# EAGLE design InductionSensorBoardForOxCNC_v2 (EAGLE 7.5.0)
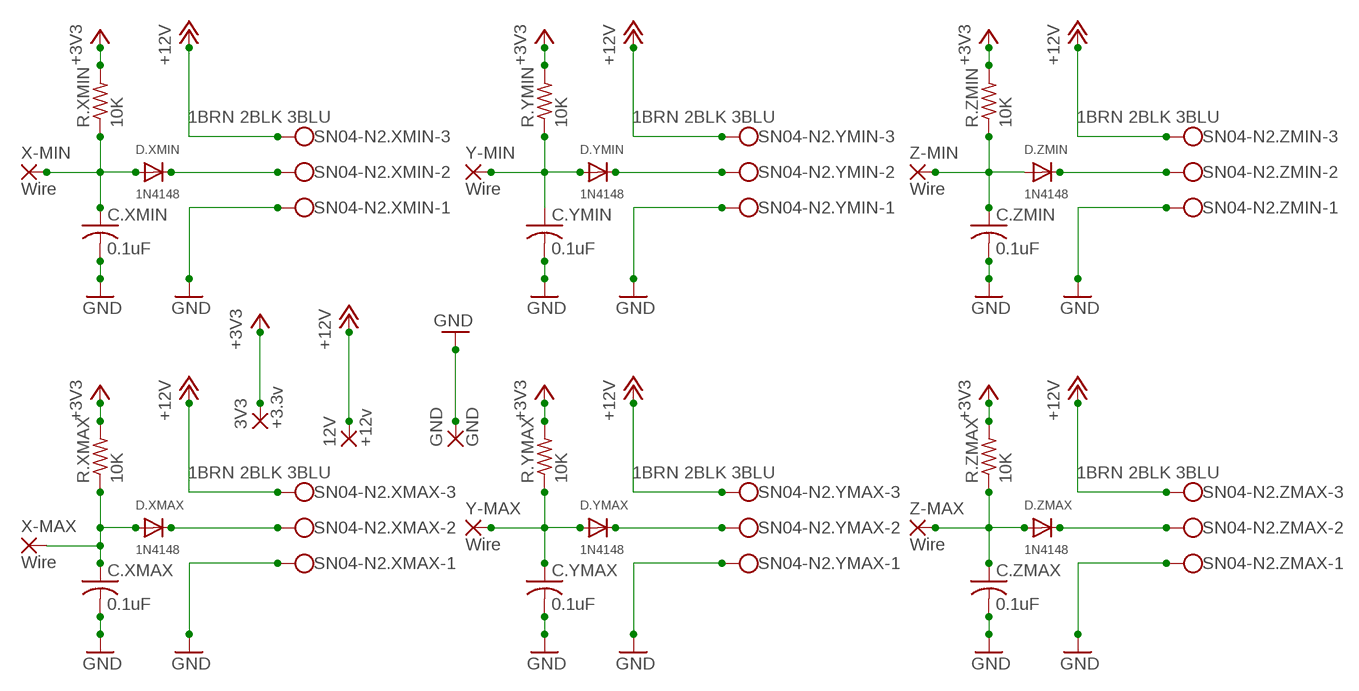
[diagram p0: schematic, sheet 1]

## Parts
3V3  +3.3v  3,81/1,4  [3,81/1,4]
12V  +12v  3,81/1,4  [3,81/1,4]
C.XMAX  0.1uF  C-US050-024X044  [C050-024X044]
C.XMIN  0.1uF  C-US050-024X044  [C050-024X044]
C.YMAX  0.1uF  C-US050-024X044  [C050-024X044]
C.YMIN  0.1uF  C-US050-024X044  [C050-024X044]
C.ZMAX  0.1uF  C-US050-024X044  [C050-024X044]
C.ZMIN  0.1uF  C-US050-024X044  [C050-024X044]
D.XMAX  1N4148  DIODEDO-1N4148  [DO-1N4148]
D.XMIN  1N4148  DIODEDO-1N4148  [DO-1N4148]
D.YMAX  1N4148  DIODEDO-1N4148  [DO-1N4148]
D.YMIN  1N4148  DIODEDO-1N4148  [DO-1N4148]
D.ZMAX  1N4148  DIODEDO-1N4148  [DO-1N4148]
D.ZMIN  1N4148  DIODEDO-1N4148  [DO-1N4148]
GND  GND  3,81/1,4  [3,81/1,4]
R.XMAX  10K  R-US_0207/10  [0207/10]
R.XMIN  10K  R-US_0207/10  [0207/10]
R.YMAX  10K  R-US_0207/10  [0207/10]
R.YMIN  10K  R-US_0207/10  [0207/10]
R.ZMAX  10K  R-US_0207/10  [0207/10]
R.ZMIN  10K  R-US_0207/10  [0207/10]
SN04-N2.XMAX  1BRN 2BLK 3BLU  W237-103  [W237-103]
SN04-N2.XMIN  1BRN 2BLK 3BLU  W237-103  [W237-103]
SN04-N2.YMAX  1BRN 2BLK 3BLU  W237-103  [W237-103]
SN04-N2.YMIN  1BRN 2BLK 3BLU  W237-103  [W237-103]
SN04-N2.ZMAX  1BRN 2BLK 3BLU  W237-103  [W237-103]
SN04-N2.ZMIN  1BRN 2BLK 3BLU  W237-103  [W237-103]
X-MAX  Wire  3,81/1,1  [3,81/1,1]
X-MIN  Wire  3,81/1,1  [3,81/1,1]
Y-MAX  Wire  3,81/1,1  [3,81/1,1]
Y-MIN  Wire  3,81/1,1  [3,81/1,1]
Z-MAX  Wire  3,81/1,1  [3,81/1,1]
Z-MIN  Wire  3,81/1,1  [3,81/1,1]

## Nets
+3V3: 3V3.1(P) R.XMAX.2 R.XMIN.2 R.YMAX.2 R.YMIN.2 R.ZMAX.2 R.ZMIN.2
+12V: 12V.1(P) SN04-N2.XMAX.3 SN04-N2.XMIN.3 SN04-N2.YMAX.3 SN04-N2.YMIN.3 SN04-N2.ZMAX.3 SN04-N2.ZMIN.3
GND: C.XMAX.2 C.XMIN.2 C.YMAX.2 C.YMIN.2 C.ZMAX.2 C.ZMIN.2 GND.1(P) SN04-N2.XMAX.1 SN04-N2.XMIN.1 SN04-N2.YMAX.1 SN04-N2.YMIN.1 SN04-N2.ZMAX.1 SN04-N2.ZMIN.1
N$1: C.XMIN.1 D.XMIN.A R.XMIN.1 X-MIN.1(P)
N$2: D.XMIN.C SN04-N2.XMIN.2
N$3: C.YMIN.1 D.YMIN.A R.YMIN.1 Y-MIN.1(P)
N$4: D.YMIN.C SN04-N2.YMIN.2
N$5: C.YMAX.1 D.YMAX.A R.YMAX.1 Y-MAX.1(P)
N$6: D.YMAX.C SN04-N2.YMAX.2
N$7: C.XMAX.1 D.XMAX.A R.XMAX.1 X-MAX.1(P)
N$8: D.XMAX.C SN04-N2.XMAX.2
N$9: C.ZMIN.1 D.ZMIN.A R.ZMIN.1 Z-MIN.1(P)
N$10: D.ZMIN.C SN04-N2.ZMIN.2
N$11: C.ZMAX.1 D.ZMAX.A R.ZMAX.1 Z-MAX.1(P)
N$12: D.ZMAX.C SN04-N2.ZMAX.2

## Library data of the parts
3V3 12V GND = wirepad:3,81/1,4: THROUGH-HOLE PAD
C.XMAX C.XMIN C.YMAX C.YMIN C.ZMAX C.ZMIN = adafruit:C-US: CAPACITOR, American symbol
D.XMAX D.XMIN D.YMAX D.YMIN D.ZMAX D.ZMIN = adafruit:DIODE: Diode SMADIODE - SMA Surface Mount Package 20V 1A Schottky Diode Digikey: 641-1014-6-ND DO-1N4148 - Through Hole Small Current Diode SOD-123 20V 1 A (.5mV Vf) Schottky Diode - Digikey: MBRX120TPMSCT-ND SOD-323 10V 570mA (.38mV Vf, 3ns) Schottky Diode - Digikey: ZLLS410CT-ND SOD-523 30V 30mA Schottky Diode (RB751S-40TE61) - Digikey: RB751S-40TE61CT-ND SOT23-R/W - SOT23 Package (R = Solder Paste/Reflow Ovens, W = Hand-Soldering) BAT54Film 40V 300mA - Digikey: 497-7162-1-ND
R.XMAX R.XMIN R.YMAX R.YMIN R.ZMAX R.ZMIN = resistor:R-US_: RESISTOR, American symbol
SN04-N2.XMAX SN04-N2.XMIN SN04-N2.YMAX SN04-N2.YMIN SN04-N2.ZMAX SN04-N2.ZMIN = con-wago-500:W237-103: WAGO SCREW CLAMP; MPN: 237-103; OC_FARNELL: unknown; OC_NEWARK: 18M7116
X-MAX X-MIN Y-MAX Y-MIN Z-MAX Z-MIN = wirepad:3,81/1,1: THROUGH-HOLE PAD

## Net classes
0 default: width 0.305 mm, drill 0.508 mm, clearance 0.254 mm

## Board
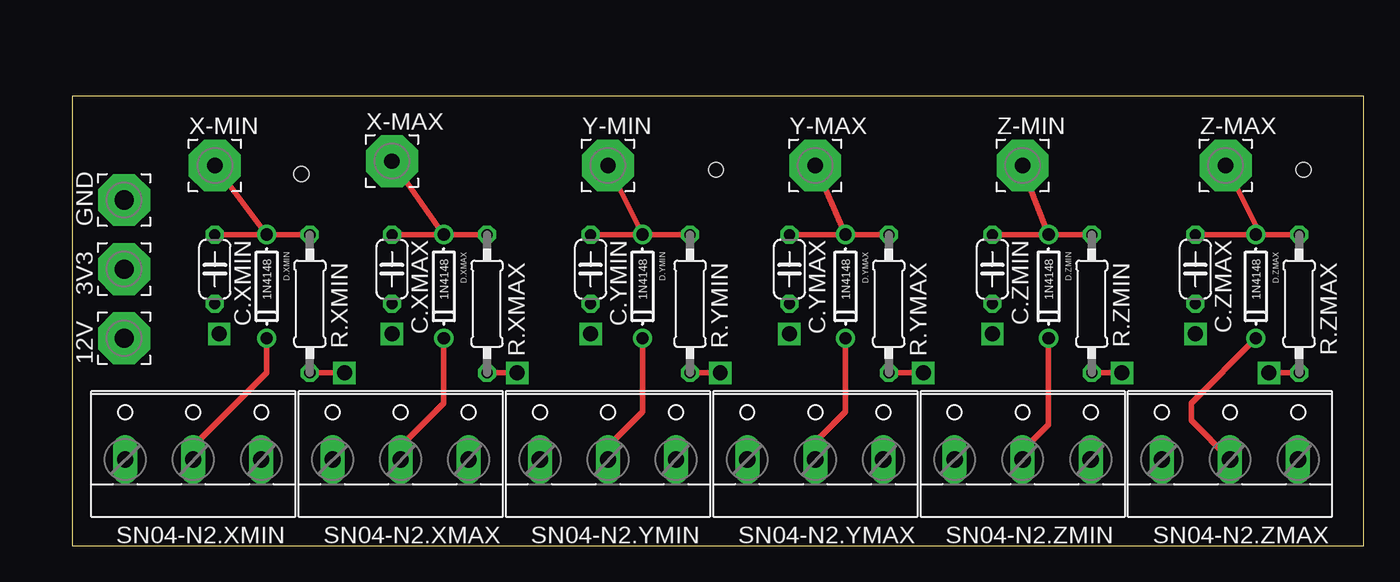
[diagram p1: board, top side]
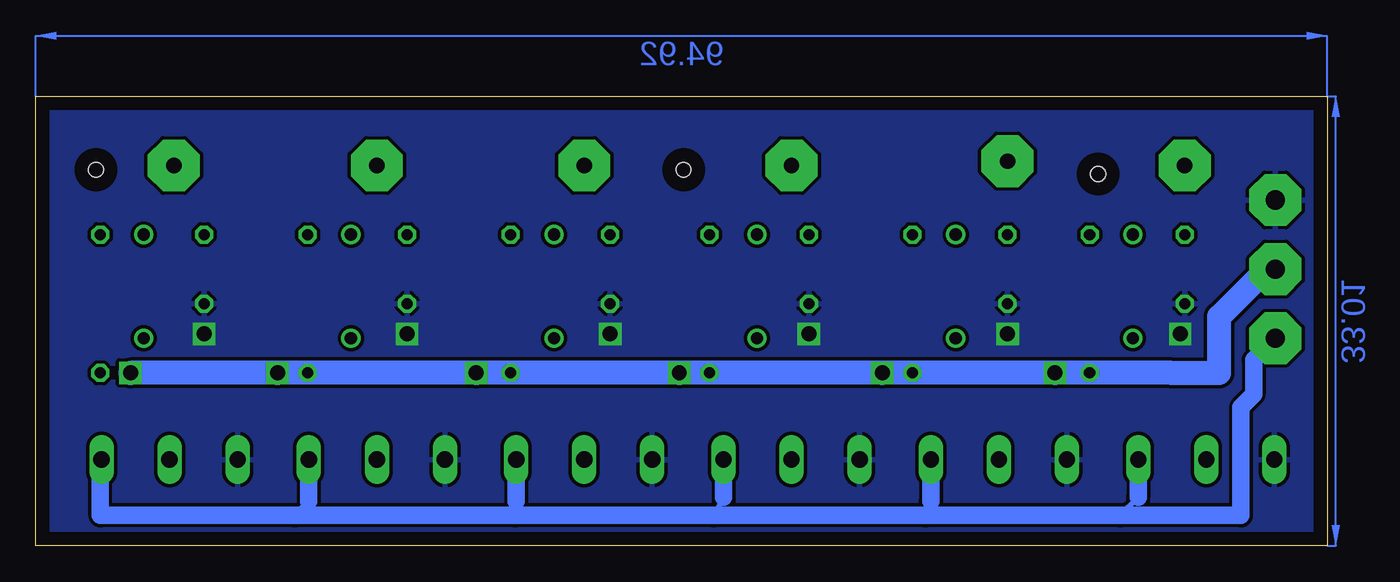
[diagram p2: board, bottom side, seen from below]

Size 94.92 x 33.01 mm. Coordinates in mm from the lower left corner, seen from the top.
Outline: 0,0 94.92,0 94.92,33.01 0,33.01 0,0
Copper layers (1*16): Top 0.035mm / dielectric 1.5mm / Bottom 0.035mm
Design rules "default": minimum track width 10mil, minimum drill 24mil, track to track 8mil, track to pad 8mil, pad to pad 8mil, via to via 8mil, smd to smd 8mil, copper to edge 40mil, drill to drill 8mil, minimum pad ring 10mil, minimum via ring 8mil, stop-mask expansion 4mil, vias tented up to drill 0mil, thermal gap 10mil
Holes 1.1 mm at 16.83,27.3 90.49,27.62 47.31,27.62

### Footprints (pad centres in the part's own frame; a part is rotated, then mirrored left to right if it is on the bottom)
3,81/1,4 = drill 1.397 pad 3.81 octagon: 1 0,0
C050-024X044 = drill 0.813 octagon: 1 -2.54,0; 2 2.54,0
DO-1N4148 = drill 0.9: A -3.81,0; C 3.81,0
0207/10 = drill 0.813 octagon: 1 -5.08,0; 2 5.08,0
W237-103 = drill 1.194 long: 1 -5,-1.29; 2 0,-1.29; 3 5,-1.29
3,81/1,1 = drill 1.118 pad 3.81 octagon: 1 0,0

### Placement (x,y rotation side)
3V3  3.81,20.32 90 top
12V  3.81,15.24 90 top
C.XMAX  23.5,20.32 270 top
C.XMIN  10.48,20.32 270 top
C.YMAX  52.7,20.32 270 top
C.YMIN  38.1,20.32 270 top
C.ZMAX  82.55,20.32 270 top
C.ZMIN  67.63,20.32 270 top
D.XMAX  27.3,19.05 270 top
D.XMIN  14.29,19.05 270 top
D.YMAX  56.83,19.05 270 top
D.YMIN  41.91,19.05 270 top
D.ZMAX  87,19.05 270 top
D.ZMIN  71.75,19.05 270 top
GND  3.81,25.4 90 top
R.XMAX  30.48,17.78 270 top
R.XMIN  17.46,17.78 270 top
R.YMAX  60.01,17.78 270 top
R.YMIN  45.4,17.78 270 top
R.ZMAX  90.17,17.78 270 top
R.ZMIN  74.93,17.78 270 top
SN04-N2.XMAX  24.13,7.62 0 top
SN04-N2.XMIN  8.89,7.62 0 top
SN04-N2.YMAX  54.61,7.62 0 top
SN04-N2.YMIN  39.37,7.62 0 top
SN04-N2.ZMAX  85.09,7.62 0 top
SN04-N2.ZMIN  69.85,7.62 0 top
X-MAX  23.5,28.26 0 top
X-MIN  10.48,27.94 0 top
Y-MAX  54.61,27.94 0 top
Y-MIN  39.37,27.94 0 top
Z-MAX  84.77,27.94 0 top
Z-MIN  69.85,27.94 0 top

### Tracks (layer width: path | path; a pad name or v marks a point on that pad's centre or on a via)
+3V3  (via drill 1.1)
  Top 0.406: v20,12.7 R.XMIN.2 | v32.7,12.7 R.XMAX.2 | v47.62,12.7 R.YMIN.2 | v62.55,12.7 R.YMAX.2 | v77.15,12.7 R.ZMIN.2 | v87.95,12.7 R.ZMAX.2
  Bottom 0.406: 4.45,20.32 3V3.1
  Bottom 1.778: v87.95,12.7 v77.15,12.7 v62.55,12.7 v47.62,12.7 v32.7,12.7 v20,12.7 11.43,12.7 7.94,12.7 7.94,16.83 4.45,20.32
+12V
  Top 0.305: 44.15,6.15 SN04-N2.YMIN.3
  Bottom 0.406: 90.17,6.25 SN04-N2.ZMAX.3 | 13.89,3.57 15.24,2.22 | 29.13,3.25 29.53,2.22 | 44.37,3.57 45.09,2.22 | 59.61,3.25 59.69,2.22 | 74.85,3.25 75.88,2.22
  Bottom 1.27: 12V.1 5.4,13.65 5.4,11.11 6.35,10.16 6.35,2.22 15.24,2.22 29.53,2.22 45.09,2.22 59.69,2.22 75.88,2.22 90.17,2.22 90.17,6.25 | SN04-N2.XMIN.3 13.89,3.57 | SN04-N2.XMAX.3 29.13,3.25 | SN04-N2.YMIN.3 44.37,3.57 | SN04-N2.YMAX.3 59.61,3.25 | SN04-N2.ZMIN.3 74.85,3.25
GND  (via drill 1.1)
  other vias: 23.5,15.56 38.1,15.56 10.79,15.56 82.55,15.56 52.7,15.56 67.63,15.56
  pour Bottom: -1.27,40.64 -1.27,-1.27 96.52,-1.27 96.52,0 96.52,40.64
N$1
  Top 0.406: R.XMIN.1 D.XMIN.A | D.XMIN.A X-MIN.1 | D.XMIN.A C.XMIN.1
N$2
  Top 0.406: SN04-N2.XMIN.2 8.89,7.3 14.29,12.7 D.XMIN.C
N$3
  Top 0.406: R.YMIN.1 D.YMIN.A | D.YMIN.A Y-MIN.1 | D.YMIN.A C.YMIN.1
N$4
  Top 0.406: SN04-N2.YMIN.2 39.37,7.3 41.91,9.84 D.YMIN.C
N$5
  Top 0.406: R.YMAX.1 D.YMAX.A | D.YMAX.A 55.56,25.72 Y-MAX.1 | D.YMAX.A C.YMAX.1
N$6
  Top 0.406: SN04-N2.YMAX.2 54.61,7.62 56.83,9.84 D.YMAX.C
N$7
  Top 0.406: R.XMAX.1 D.XMAX.A | D.XMAX.A 25.72,25.08 X-MAX.1 | D.XMAX.A C.XMAX.1
N$8
  Top 0.406: SN04-N2.XMAX.2 24.13,7.3 27.3,10.48 D.XMAX.C
N$9
  Top 0.406: R.ZMIN.1 D.ZMIN.A | D.ZMIN.A C.ZMIN.1 | D.ZMIN.A 70.48,26.04 Z-MIN.1
N$10
  Top 0.406: SN04-N2.ZMIN.2 69.85,6.99 71.75,8.89 D.ZMIN.C
N$11
  Top 0.406: R.ZMAX.1 D.ZMAX.A | D.ZMAX.A 87,23.5 Z-MAX.1 | D.ZMAX.A C.ZMAX.1
N$12
  Top 0.406: SN04-N2.ZMAX.2 85.09,6.35 82.23,9.21 82.23,10.48 D.ZMAX.C
(copper drawn outside any net)
  shapes: Bottom area x2